# Altium project NFC-Reader.PrjPcb (part 8 of 11)
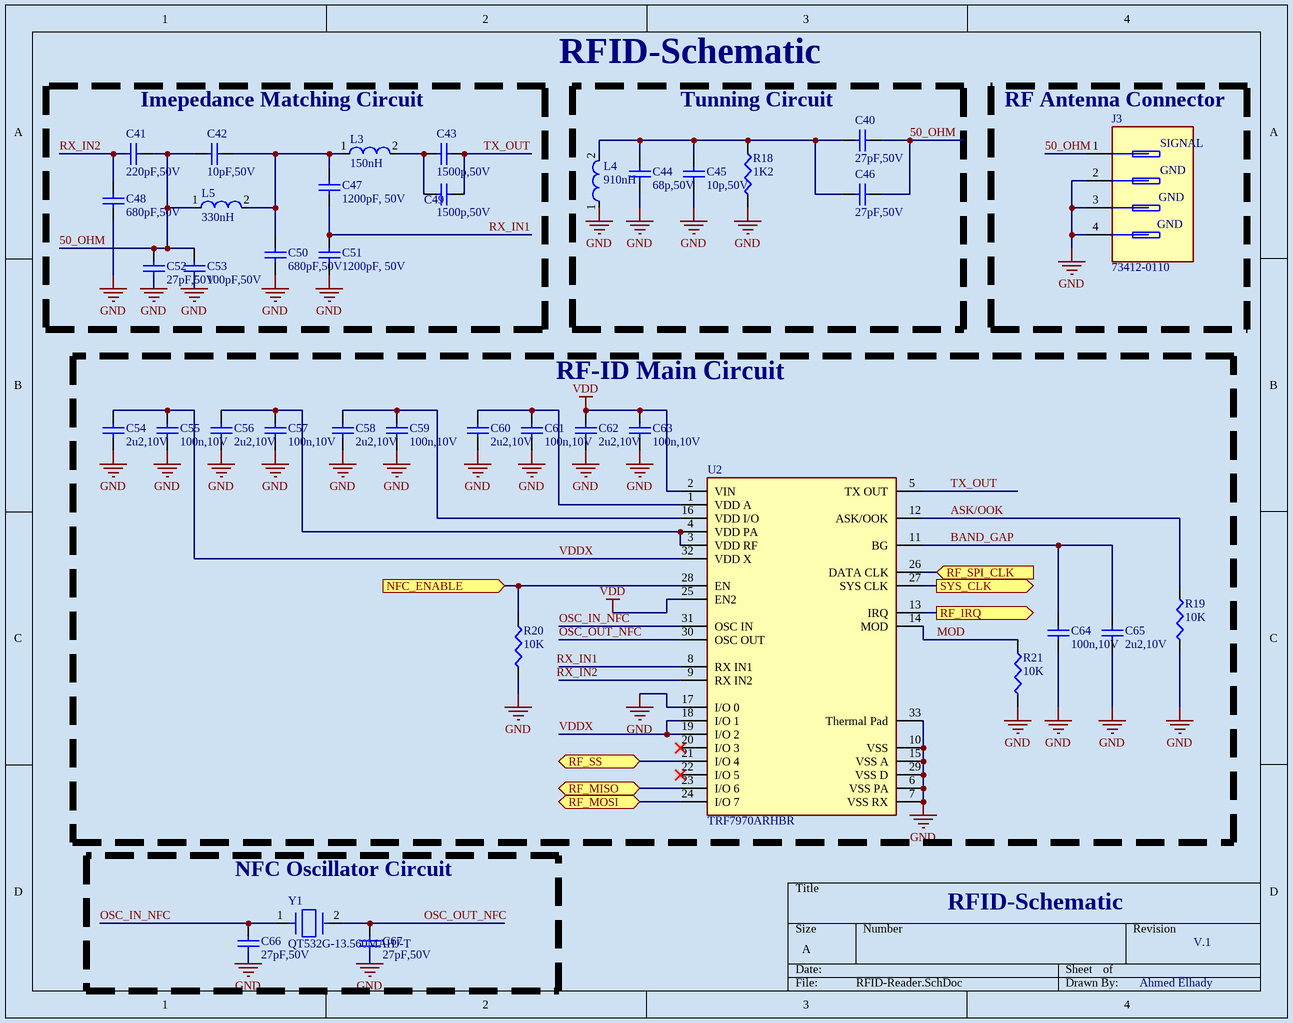
[diagram p11: RFID-Reader.SchDoc]

## Sheet RFID-Reader.SchDoc (continued)
### Library data of the parts
C40 C46 C52 C66 C67 = CC0402JRNPO9BN270: 27 pF ±5% 50V Ceramic Capacitor C0G, NP0 0402 (1005 Metric); Manufacturer: Yageo Group; Temperature Coefficient: 30ppm/°C; Supplier: DigiKey; Manufacturer Part Number: CC0402JRNPO9BN270; RoHS: Compliant; Category: Ceramic Capacitors; Stock: 41685; Pricing: 1=0.1, 10=0.024, 50=0.0156, 100=0.0133, 500=0.00934, 1000=0.00812, 2500=0.00685, 5000=0.00609, 10000=0.00546, 20000=0.00495, 30000=0.0047, 50000=0.0047 (USD); Value: 27pF; Case/Package: 0402; Case Code (Imperial): 0402; Case Code (Metric): 1005; China RoHS: Compliant; Composition: Ceramic; Depth: 500µm; Dielectric: C0G; Dielectric Material: Ceramic; Halogen Free: Halogen Free; Height: 500µm; Lead Free: Lead Free; Length: 1mm; Lifecycle Status: Production; Max Operating Temperature: 125°C; Min Operating Temperature: -55°C; Mounting Technology: Surface Mount; Pins: 2; Number of Terminals: 2; Radiation Hardening: No; REACH SVHC: Yes; Schedule B: 8532240020, 8532240020|8532240020, 8532240020|8532240020|8532240020, 8532240020|8532240020|8532240020|8532240020; Termination: SMD/SMT; Thickness: 558.8µm; Tolerance: 5%; Voltage Rating: 50V; Voltage Rating (DC): 50V; Width: 500µm; ComponentLink1URL: https://datasheet.octopart.com:443/CC0402JRNPO9BN270-Yageo-datasheet-182140217.pdf?src-supplier=IHS; ComponentLink1Description: https://datasheet.octopart.com:443/CC0402JRNPO9BN270-Yageo-datasheet-182140217.pdf?src-supplier=IHS; ComponentLink2URL: https://datasheet.octopart.com:443/CC0402JRNPO9BN270-Yageo-datasheet-10406438.pdf?src-supplier=element14+APAC; ComponentLink2Description: https://datasheet.octopart.com:443/CC0402JRNPO9BN270-Yageo-datasheet-10406438.pdf?src-supplier=element14+APAC; ComponentLink3URL: https://datasheet.octopart.com:443/CC0402JRNPO9BN270-Yageo-datasheet-67645495.pdf?src-supplier=element14+APAC; ComponentLink3Description: https://datasheet.octopart.com:443/CC0402JRNPO9BN270-Yageo-datasheet-67645495.pdf?src-supplier=element14+APAC; ComponentLink4URL: https://datasheet.octopart.com:443/CC0402JRNPO9BN270-Yageo-datasheet-10882999.pdf?src-supplier=element14+APAC; ComponentLink4Description: https://datasheet.octopart.com:443/CC0402JRNPO9BN270-Yageo-datasheet-10882999.pdf?src-supplier=element14+APAC; ComponentLink5URL: https://datasheet.octopart.com:443/CC0402JRNPO9BN270-Yageo-datasheet-151948684.pdf?src-supplier=Farnell; ComponentLink5Description: https://datasheet.octopart.com:443/CC0402JRNPO9BN270-Yageo-datasheet-151948684.pdf?src-supplier=Farnell; ComponentLink6URL: https://datasheet.octopart.com:443/CC0402JRNPO9BN270-Yageo-datasheet-65873193.pdf?src-supplier=Farnell; ComponentLink6Description: https://datasheet.octopart.com:443/CC0402JRNPO9BN270-Yageo-datasheet-65873193.pdf?src-supplier=Farnell; ComponentLink7URL: https://datasheet.octopart.com:443/CC0402JRNPO9BN270-Yageo-datasheet-137875056.pdf?src-supplier=Future+Electronics; ComponentLink7Description: https://datasheet.octopart.com:443/CC0402JRNPO9BN270-Yageo-datasheet-137875056.pdf?src-supplier=Future+Electronics; ComponentLink8URL: https://datasheet.octopart.com:443/CC0402JRNPO9BN270-Yageo-datasheet-136957424.pdf?src-supplier=Future+Electronics; ComponentLink8Description: https://datasheet.octopart.com:443/CC0402JRNPO9BN270-Yageo-datasheet-136957424.pdf?src-supplier=Future+Electronics; ComponentLink9URL: https://datasheet.octopart.com:443/CC0402JRNPO9BN270-Yageo-datasheet-137700082.pdf?src-supplier=Future+Electronics; ComponentLink9Description: https://datasheet.octopart.com:443/CC0402JRNPO9BN270-Yageo-datasheet-137700082.pdf?src-supplier=Future+Electronics; ComponentLink10URL: https://datasheet.octopart.com:443/CC0402JRNPO9BN270-Yageo-datasheet-78855684.pdf?src-supplier=Future+Electronics; ComponentLink10Description: https://datasheet.octopart.com:443/CC0402JRNPO9BN270-Yageo-datasheet-78855684.pdf?src-supplier=Future+Electronics; ComponentLink11URL: https://datasheet.octopart.com:443/CC0402JRNPO9BN270-Yageo-datasheet-16730043.pdf?src-supplier=Future+Electronics; ComponentLink11Description: https://datasheet.octopart.com:443/CC0402JRNPO9BN270-Yageo-datasheet-16730043.pdf?src-supplier=Future+Electronics; ComponentLink12URL: https://datasheet.octopart.com:443/CC0402JRNPO9BN270-Yageo-datasheet-12589826.pdf?src-supplier=Future+Electronics; ComponentLink12Description: https://datasheet.octopart.com:443/CC0402JRNPO9BN270-Yageo-datasheet-12589826.pdf?src-supplier=Future+Electronics; ComponentLink13URL: https://datasheet.octopart.com:443/CC0402JRNPO9BN270-Yageo-datasheet-181967032.pdf?src-supplier=Newark; ComponentLink13Description: https://datasheet.octopart.com:443/CC0402JRNPO9BN270-Yageo-datasheet-181967032.pdf?src-supplier=Newark; ComponentLink14URL: https://datasheet.octopart.com:443/CC0402JRNPO9BN270-Yageo-datasheet-8817079.pdf?src-supplier=element14; ComponentLink14Description: https://datasheet.octopart.com:443/CC0402JRNPO9BN270-Yageo-datasheet-8817079.pdf?src-supplier=element14; ComponentLink15URL: https://datasheet.octopart.com:443/CC0402JRNPO9BN270-Yageo-datasheet-8324240.pdf?src-supplier=element14; ComponentLink15Description: https://datasheet.octopart.com:443/CC0402JRNPO9BN270-Yageo-datasheet-8324240.pdf?src-supplier=element14; ComponentLink16URL: https://datasheet.octopart.com:443/CC0402JRNPO9BN270-Yageo-datasheet-504625.pdf?src-supplier=element14; ComponentLink16Description: https://datasheet.octopart.com:443/CC0402JRNPO9BN270-Yageo-datasheet-504625.pdf?src-supplier=element14; ComponentLink17URL: https://datasheet.octopart.com:443/CC0402JRNPO9BN270-Yageo-datasheet-5321569.pdf?src-supplier=element14; ComponentLink17Description: https://datasheet.octopart.com:443/CC0402JRNPO9BN270-Yageo-datasheet-5321569.pdf?src-supplier=element14; ComponentLink18URL: http://sigma.octopart.com:80/rohs_statement/Yageo-company-2.pdf?src-supplier=Compliance+Statements; ComponentLink18Description: http://sigma.octopart.com:80/rohs_statement/Yageo-company-2.pdf?src-supplier=Compliance+Statements; ComponentLink19URL: http://sigma.octopart.com:80/conflict_mineral_statement/Yageo-company-3.pdf?src-supplier=Compliance+Statements; ComponentLink19Description: http://sigma.octopart.com:80/conflict_mineral_statement/Yageo-company-3.pdf?src-supplier=Compliance+Statements; LCSC PN: C107002
C41 = CC0402JRNPO8BN221: 220 pF ±5% 25V Ceramic Capacitor C0G, NP0 0402 (1005 Metric); Manufacturer: Yageo Group; Supplier: DigiKey; Manufacturer Part Number: CC0402JRNPO8BN221; RoHS: Compliant; Category: Ceramic Capacitors; Stock: 15798; Pricing: 1=0.1, 10=0.033, 50=0.0218, 100=0.0187, 500=0.01332, 1000=0.01168, 2500=0.00996, 5000=0.00893 (USD); Value: 220pF; Case/Package: 0402; Case Code (Imperial): 0402; Case Code (Metric): 1005; China RoHS: Compliant; Composition: Ceramic; Depth: 500µm; Dielectric: C0G; Dielectric Material: Ceramic; Halogen Free: Halogen Free; Height: 500µm; Lead Free: Lead Free; Length: 1mm; Lifecycle Status: Production; Max Operating Temperature: 125°C; Min Operating Temperature: -55°C; Mounting Technology: Surface Mount; Number of Terminals: 2; Packaging: Digi-Reel®; Radiation Hardening: No; REACH SVHC: Yes; Schedule B: 8532240020, 8532240020|8532240020, 8532240020|8532240020|8532240020, 8532240020|8532240020|8532240020|8532240020; Termination: SMD/SMT; Thickness: 558.8µm; Tolerance: 5%; Voltage Rating: 25V; Voltage Rating (DC): 25V; Weight: 652.039032µg; Width: 500µm; ComponentLink1URL: https://datasheet.octopart.com:443/CC0402JRNPO8BN221-Yageo-datasheet-182140217.pdf?src-supplier=IHS; ComponentLink1Description: https://datasheet.octopart.com:443/CC0402JRNPO8BN221-Yageo-datasheet-182140217.pdf?src-supplier=IHS; ComponentLink2URL: https://datasheet.octopart.com:443/CC0402JRNPO8BN221-Yageo-datasheet-182878122.pdf?src-supplier=Farnell; ComponentLink2Description: https://datasheet.octopart.com:443/CC0402JRNPO8BN221-Yageo-datasheet-182878122.pdf?src-supplier=Farnell; ComponentLink3URL: https://datasheet.octopart.com:443/CC0402JRNPO8BN221-Yageo-Group-datasheet-188689597.pdf?src-supplier=Farnell; ComponentLink3Description: https://datasheet.octopart.com:443/CC0402JRNPO8BN221-Yageo-Group-datasheet-188689597.pdf?src-supplier=Farnell; ComponentLink4URL: https://datasheet.octopart.com:443/CC0402JRNPO8BN221-Yageo-datasheet-151948684.pdf?src-supplier=Newark; ComponentLink4Description: https://datasheet.octopart.com:443/CC0402JRNPO8BN221-Yageo-datasheet-151948684.pdf?src-supplier=Newark; ComponentLink5URL: https://datasheet.octopart.com:443/CC0402JRNPO8BN221-Yageo-datasheet-137875056.pdf?src-supplier=JRH+Electronics; ComponentLink5Description: https://datasheet.octopart.com:443/CC0402JRNPO8BN221-Yageo-datasheet-137875056.pdf?src-supplier=JRH+Electronics; ComponentLink6URL: https://datasheet.octopart.com:443/CC0402JRNPO8BN221-Yageo-datasheet-10406438.pdf?src-supplier=_legacy+Avnet; ComponentLink6Description: https://datasheet.octopart.com:443/CC0402JRNPO8BN221-Yageo-datasheet-10406438.pdf?src-supplier=_legacy+Avnet; ComponentLink7URL: https://datasheet.octopart.com:443/CC0402JRNPO8BN221-Yageo-datasheet-136957424.pdf?src-supplier=Future+Electronics; ComponentLink7Description: https://datasheet.octopart.com:443/CC0402JRNPO8BN221-Yageo-datasheet-136957424.pdf?src-supplier=Future+Electronics; ComponentLink8URL: https://datasheet.octopart.com:443/CC0402JRNPO8BN221-Yageo-datasheet-137700082.pdf?src-supplier=Future+Electronics; ComponentLink8Description: https://datasheet.octopart.com:443/CC0402JRNPO8BN221-Yageo-datasheet-137700082.pdf?src-supplier=Future+Electronics; ComponentLink9URL: https://datasheet.octopart.com:443/CC0402JRNPO8BN221-Yageo-datasheet-78855684.pdf?src-supplier=Future+Electronics; ComponentLink9Description: https://datasheet.octopart.com:443/CC0402JRNPO8BN221-Yageo-datasheet-78855684.pdf?src-supplier=Future+Electronics; ComponentLink10URL: https://datasheet.octopart.com:443/CC0402JRNPO8BN221-Yageo-datasheet-24578986.pdf?src-supplier=Future+Electronics; ComponentLink10Description: https://datasheet.octopart.com:443/CC0402JRNPO8BN221-Yageo-datasheet-24578986.pdf?src-supplier=Future+Electronics; ComponentLink11URL: https://datasheet.octopart.com:443/CC0402JRNPO8BN221-Yageo-datasheet-16730043.pdf?src-supplier=Future+Electronics; ComponentLink11Description: https://datasheet.octopart.com:443/CC0402JRNPO8BN221-Yageo-datasheet-16730043.pdf?src-supplier=Future+Electronics; ComponentLink12URL: https://datasheet.octopart.com:443/CC0402JRNPO8BN221-Yageo-datasheet-12589826.pdf?src-supplier=Future+Electronics; ComponentLink12Description: https://datasheet.octopart.com:443/CC0402JRNPO8BN221-Yageo-datasheet-12589826.pdf?src-supplier=Future+Electronics; ComponentLink13URL: http://sigma.octopart.com:80/rohs_statement/Yageo-company-2.pdf?src-supplier=Compliance+Statements; ComponentLink13Description: http://sigma.octopart.com:80/rohs_statement/Yageo-company-2.pdf?src-supplier=Compliance+Statements; ComponentLink14URL: http://sigma.octopart.com:80/conflict_mineral_statement/Yageo-company-3.pdf?src-supplier=Compliance+Statements; ComponentLink14Description: http://sigma.octopart.com:80/conflict_mineral_statement/Yageo-company-3.pdf?src-supplier=Compliance+Statements; LCSC PN: C541367
C42 = CC0402JRNPO9BN100: 10 pF ±5% 50V Ceramic Capacitor C0G, NP0 0402 (1005 Metric); Manufacturer: Yageo Group; Insulation Resistance: 100GΩ; Temperature Coefficient: 30ppm/°C; Supplier: DigiKey; Manufacturer Part Number: CC0402JRNPO9BN100; RoHS: Compliant; Category: Ceramic Capacitors; Stock: 623063; Pricing: 1=0.1, 10=0.024, 50=0.0156, 100=0.0133, 500=0.00934, 1000=0.00812, 2500=0.00685, 5000=0.00609, 10000=0.00547, 20000=0.00495, 30000=0.0047, 50000=0.00441, 70000=0.00425, 100000=0.00409, 120000=0.00401, 240000=0.00376, 250000=0.00374 (USD); Value: 10pF; Case/Package: 0402; Case Code (Imperial): 0402; Case Code (Metric): 1005; China RoHS: Compliant; Composition: Ceramic; Depth: 500µm; Dielectric: C0G; Dielectric Material: Ceramic; Halogen Free: Halogen Free; Height: 500µm; Lead Free: Lead Free; Length: 1mm; Lifecycle Status: Production; Max Operating Temperature: 125°C; Min Operating Temperature: -55°C; Mounting Technology: Surface Mount; Pins: 2; Number of Terminals: 2; Radiation Hardening: No; REACH SVHC: Yes; Schedule B: 8532240020, 8532240020|8532240020|8532240020|8532240020|8532240020|8532240020|8532240020|8532240020|8532240020|8532240020|8532240020|8532240020|8532240020|8532240020|8532240020|8532240020|8532240020|8532240020|8532240020|8532240020|8532240020|8532240020|8532240020|85; Termination: SMD/SMT; Thickness: 558.8µm; Tolerance: 5%; Voltage: 50V; Voltage Rating: 50V; Voltage Rating (AC): 50V; Voltage Rating (DC): 50V; Width: 500µm; ComponentLink1URL: https://datasheet.octopart.com:443/CC0402JRNPO9BN100-Yageo-datasheet-182140217.pdf?src-supplier=IHS; ComponentLink1Description: https://datasheet.octopart.com:443/CC0402JRNPO9BN100-Yageo-datasheet-182140217.pdf?src-supplier=IHS; ComponentLink2URL: https://datasheet.octopart.com:443/CC0402JRNPO9BN100-Yageo-datasheet-78855684.pdf?src-supplier=Upverter; ComponentLink2Description: https://datasheet.octopart.com:443/CC0402JRNPO9BN100-Yageo-datasheet-78855684.pdf?src-supplier=Upverter; ComponentLink3URL: https://datasheet.octopart.com:443/CC0402JRNPO9BN100-Yageo-datasheet-10406438.pdf?src-supplier=element14+APAC; ComponentLink3Description: https://datasheet.octopart.com:443/CC0402JRNPO9BN100-Yageo-datasheet-10406438.pdf?src-supplier=element14+APAC; ComponentLink4URL: https://datasheet.octopart.com:443/CC0402JRNPO9BN100-Yageo-datasheet-151948684.pdf?src-supplier=element14+APAC; ComponentLink4Description: https://datasheet.octopart.com:443/CC0402JRNPO9BN100-Yageo-datasheet-151948684.pdf?src-supplier=element14+APAC; ComponentLink5URL: https://datasheet.octopart.com:443/CC0402JRNPO9BN100-Yageo-datasheet-65873193.pdf?src-supplier=element14+APAC; ComponentLink5Description: https://datasheet.octopart.com:443/CC0402JRNPO9BN100-Yageo-datasheet-65873193.pdf?src-supplier=element14+APAC; ComponentLink6URL: https://datasheet.octopart.com:443/CC0402JRNPO9BN100-Yageo-datasheet-67645495.pdf?src-supplier=element14+APAC; ComponentLink6Description: https://datasheet.octopart.com:443/CC0402JRNPO9BN100-Yageo-datasheet-67645495.pdf?src-supplier=element14+APAC; ComponentLink7URL: https://datasheet.octopart.com:443/CC0402JRNPO9BN100-Yageo-datasheet-10882999.pdf?src-supplier=element14+APAC; ComponentLink7Description: https://datasheet.octopart.com:443/CC0402JRNPO9BN100-Yageo-datasheet-10882999.pdf?src-supplier=element14+APAC; ComponentLink8URL: https://datasheet.octopart.com:443/CC0402JRNPO9BN100-Yageo-datasheet-504625.pdf?src-supplier=element14; ComponentLink8Description: https://datasheet.octopart.com:443/CC0402JRNPO9BN100-Yageo-datasheet-504625.pdf?src-supplier=element14; ComponentLink9URL: https://datasheet.octopart.com:443/CC0402JRNPO9BN100-Yageo-datasheet-8817079.pdf?src-supplier=element14; ComponentLink9Description: https://datasheet.octopart.com:443/CC0402JRNPO9BN100-Yageo-datasheet-8817079.pdf?src-supplier=element14; ComponentLink10URL: https://datasheet.octopart.com:443/CC0402JRNPO9BN100-Yageo-datasheet-8324240.pdf?src-supplier=element14; ComponentLink10Description: https://datasheet.octopart.com:443/CC0402JRNPO9BN100-Yageo-datasheet-8324240.pdf?src-supplier=element14; ComponentLink11URL: https://datasheet.octopart.com:443/CC0402JRNPO9BN100-Yageo-datasheet-5321569.pdf?src-supplier=element14; ComponentLink11Description: https://datasheet.octopart.com:443/CC0402JRNPO9BN100-Yageo-datasheet-5321569.pdf?src-supplier=element14; ComponentLink12URL: https://datasheet.octopart.com:443/CC0402JRNPO9BN100-Yageo-datasheet-5301394.pdf?src-supplier=Newark; ComponentLink12Description: https://datasheet.octopart.com:443/CC0402JRNPO9BN100-Yageo-datasheet-5301394.pdf?src-supplier=Newark; ComponentLink13URL: https://datasheet.octopart.com:443/CC0402JRNPO9BN100-Yageo-datasheet-182050769.pdf?src-supplier=Newark; ComponentLink13Description: https://datasheet.octopart.com:443/CC0402JRNPO9BN100-Yageo-datasheet-182050769.pdf?src-supplier=Newark; ComponentLink14URL: https://datasheet.octopart.com:443/CC0402JRNPO9BN100-Yageo-datasheet-182050768.pdf?src-supplier=Newark; ComponentLink14Description: https://datasheet.octopart.com:443/CC0402JRNPO9BN100-Yageo-datasheet-182050768.pdf?src-supplier=Newark; ComponentLink15URL: https://datasheet.octopart.com:443/CC0402JRNPO9BN100-Yageo-datasheet-137875056.pdf?src-supplier=Future+Electronics; ComponentLink15Description: https://datasheet.octopart.com:443/CC0402JRNPO9BN100-Yageo-datasheet-137875056.pdf?src-supplier=Future+Electronics; ComponentLink16URL: https://datasheet.octopart.com:443/CC0402JRNPO9BN100-Yageo-datasheet-136957424.pdf?src-supplier=Future+Electronics; ComponentLink16Description: https://datasheet.octopart.com:443/CC0402JRNPO9BN100-Yageo-datasheet-136957424.pdf?src-supplier=Future+Electronics; ComponentLink17URL: https://datasheet.octopart.com:443/CC0402JRNPO9BN100-Yageo-datasheet-137700082.pdf?src-supplier=Future+Electronics; ComponentLink17Description: https://datasheet.octopart.com:443/CC0402JRNPO9BN100-Yageo-datasheet-137700082.pdf?src-supplier=Future+Electronics; ComponentLink18URL: https://datasheet.octopart.com:443/CC0402JRNPO9BN100-Yageo-datasheet-62126864.pdf?src-supplier=Future+Electronics; ComponentLink18Description: https://datasheet.octopart.com:443/CC0402JRNPO9BN100-Yageo-datasheet-62126864.pdf?src-supplier=Future+Electronics; ComponentLink19URL: https://datasheet.octopart.com:443/CC0402JRNPO9BN100-Yageo-datasheet-62091628.pdf?src-supplier=Future+Electronics; ComponentLink19Description: https://datasheet.octopart.com:443/CC0402JRNPO9BN100-Yageo-datasheet-62091628.pdf?src-supplier=Future+Electronics; ComponentLink20URL: https://datasheet.octopart.com:443/CC0402JRNPO9BN100-Yageo-datasheet-24578986.pdf?src-supplier=Future+Electronics; ComponentLink20Description: https://datasheet.octopart.com:443/CC0402JRNPO9BN100-Yageo-datasheet-24578986.pdf?src-supplier=Future+Electronics; ComponentLink21URL: https://datasheet.octopart.com:443/CC0402JRNPO9BN100-Yageo-datasheet-16730043.pdf?src-supplier=Future+Electronics; ComponentLink21Description: https://datasheet.octopart.com:443/CC0402JRNPO9BN100-Yageo-datasheet-16730043.pdf?src-supplier=Future+Electronics; ComponentLink22URL: https://datasheet.octopart.com:443/CC0402JRNPO9BN100-Yageo-datasheet-12589826.pdf?src-supplier=Future+Electronics; ComponentLink22Description: https://datasheet.octopart.com:443/CC0402JRNPO9BN100-Yageo-datasheet-12589826.pdf?src-supplier=Future+Electronics; ComponentLink23URL: https://datasheet.octopart.com:443/CC0402JRNPO9BN100-Yageo-datasheet-10621397.pdf?src-supplier=Farnell; ComponentLink23Description: https://datasheet.octopart.com:443/CC0402JRNPO9BN100-Yageo-datasheet-10621397.pdf?src-supplier=Farnell; ComponentLink24URL: http://sigma.octopart.com:80/rohs_statement/Yageo-company-2.pdf?src-supplier=Compliance+Statements; ComponentLink24Description: http://sigma.octopart.com:80/rohs_statement/Yageo-company-2.pdf?src-supplier=Compliance+Statements; ComponentLink25URL: http://sigma.octopart.com:80/conflict_mineral_statement/Yageo-company-3.pdf?src-supplier=Compliance+Statements; ComponentLink25Description: http://sigma.octopart.com:80/conflict_mineral_statement/Yageo-company-3.pdf?src-supplier=Compliance+Statements; LCSC PN: C106199
C43 C49 = GRM155R71H152KA01D: 1500 pF ±10% 50V Ceramic Capacitor X7R 0402 (1005 Metric); Manufacturer: Murata; Manufacturer Lifecycle Status: NRND; Value: 1.5nF; Supplier: DigiKey; Manufacturer Part Number: GRM155R71H152KA01D; RoHS: Compliant; Category: Ceramic Capacitors; Stock: 112151; Pricing: 1=0.1, 10=0.021, 50=0.0138, 100=0.0117, 500=0.00816, 1000=0.00708, 2500=0.00572, 5000=0.00527, 10000=0.00425, 20000=0.00326, 30000=0.00324, 50000=0.00322, 70000=0.0032, 100000=0.00314, 120000=0.00308, 240000=0.00288, 250000=0.00287 (USD); Case/Package: 0402; Case Code (Imperial): 0402; Case Code (Metric): 1005; Depth: 500µm; Dielectric: X7R; Dielectric Material: Ceramic; Height: 500µm; Lead Free: Lead Free; Length: 1mm; Lifecycle Status: NRND; Material: Ceramic; Max Operating Temperature: 125°C; Min Operating Temperature: -55°C; Mounting Technology: Surface Mount; Pins: 2; Number of Terminals: 2; Packaging: Cut Tape; Radiation Hardening: No; REACH SVHC: Yes; Schedule B: 8532240020, 8532240020|8532240020, 8532240020|8532240020|8532240020, 8532240020|8532240020|8532240020|8532240020; Termination: SMD/SMT; Thickness: 500µm; Tolerance: 10%; Voltage: 50V; Voltage Rating: 50V; Voltage Rating (DC): 50V; Width: 500µm; ComponentLink1URL: https://datasheet.octopart.com:443/GRM155R71H152KA01D-Murata-datasheet-8817987.pdf?src-supplier=element14+APAC; ComponentLink1Description: https://datasheet.octopart.com:443/GRM155R71H152KA01D-Murata-datasheet-8817987.pdf?src-supplier=element14+APAC; ComponentLink2URL: https://datasheet.octopart.com:443/GRM155R71H152KA01D-Murata-datasheet-62317135.pdf?src-supplier=element14+APAC; ComponentLink2Description: https://datasheet.octopart.com:443/GRM155R71H152KA01D-Murata-datasheet-62317135.pdf?src-supplier=element14+APAC; ComponentLink3URL: https://datasheet.octopart.com:443/GRM155R71H152KA01D-Murata-datasheet-8326276.pdf?src-supplier=_legacy+Avnet; ComponentLink3Description: https://datasheet.octopart.com:443/GRM155R71H152KA01D-Murata-datasheet-8326276.pdf?src-supplier=_legacy+Avnet; ComponentLink4URL: https://datasheet.octopart.com/GRM155R71H152KA01D-Murata-datasheet-12534922.pdf; ComponentLink4Description: https://datasheet.octopart.com/GRM155R71H152KA01D-Murata-datasheet-12534922.pdf; ComponentLink5URL: https://datasheet.octopart.com/GRM155R71H152KA01D-Murata-datasheet-12515295.pdf; ComponentLink5Description: https://datasheet.octopart.com/GRM155R71H152KA01D-Murata-datasheet-12515295.pdf; ComponentLink6URL: https://datasheet.octopart.com/GRM155R71H152KA01D-Murata-datasheet-12510076.pdf; ComponentLink6Description: https://datasheet.octopart.com/GRM155R71H152KA01D-Murata-datasheet-12510076.pdf; ComponentLink7URL: https://datasheet.octopart.com/GRM155R71H152KA01D-Murata-datasheet-11978611.pdf; ComponentLink7Description: https://datasheet.octopart.com/GRM155R71H152KA01D-Murata-datasheet-11978611.pdf; ComponentLink8URL: https://datasheet.octopart.com/GRM155R71H152KA01D-Murata-datasheet-10025737.pdf; ComponentLink8Description: https://datasheet.octopart.com/GRM155R71H152KA01D-Murata-datasheet-10025737.pdf; ComponentLink9URL: https://datasheet.octopart.com/GRM155R71H152KA01D-Murata-datasheet-8819587.pdf; ComponentLink9Description: https://datasheet.octopart.com/GRM155R71H152KA01D-Murata-datasheet-8819587.pdf; ComponentLink10URL: https://datasheet.octopart.com:443/GRM155R71H152KA01D-Murata-datasheet-141266224.pdf?src-supplier=Ciiva; ComponentLink10Description: https://datasheet.octopart.com:443/GRM155R71H152KA01D-Murata-datasheet-141266224.pdf?src-supplier=Ciiva; ComponentLink11URL: https://datasheet.octopart.com:443/GRM155R71H152KA01D-Murata-datasheet-140691779.pdf?src-supplier=Ciiva; ComponentLink11Description: https://datasheet.octopart.com:443/GRM155R71H152KA01D-Murata-datasheet-140691779.pdf?src-supplier=Ciiva; ComponentLink12URL: https://datasheet.octopart.com:443/GRM155R71H152KA01D-Murata-datasheet-138797361.pdf?src-supplier=Ciiva; ComponentLink12Description: https://datasheet.octopart.com:443/GRM155R71H152KA01D-Murata-datasheet-138797361.pdf?src-supplier=Ciiva; ComponentLink13URL: https://datasheet.octopart.com:443/GRM155R71H152KA01D-Murata-datasheet-138740991.pdf?src-supplier=Ciiva; ComponentLink13Description: https://datasheet.octopart.com:443/GRM155R71H152KA01D-Murata-datasheet-138740991.pdf?src-supplier=Ciiva; ComponentLink14URL: https://datasheet.octopart.com:443/GRM155R71H152KA01D-Murata-datasheet-81455584.pdf?src-supplier=TME; ComponentLink14Description: https://datasheet.octopart.com:443/GRM155R71H152KA01D-Murata-datasheet-81455584.pdf?src-supplier=TME; ComponentLink15URL: https://datasheet.octopart.com:443/GRM155R71H152KA01D-Murata-datasheet-22122223.pdf?src-supplier=Future+Electronics; ComponentLink15Description: https://datasheet.octopart.com:443/GRM155R71H152KA01D-Murata-datasheet-22122223.pdf?src-supplier=Future+Electronics; ComponentLink16URL: https://datasheet.octopart.com:443/GRM155R71H152KA01D-Murata-datasheet-44106597.pdf?src-supplier=Future+Electronics; ComponentLink16Description: https://datasheet.octopart.com:443/GRM155R71H152KA01D-Murata-datasheet-44106597.pdf?src-supplier=Future+Electronics; ComponentLink17URL: https://datasheet.octopart.com:443/GRM155R71H152KA01D-Murata-datasheet-11794207.pdf?src-supplier=Arrow+Electronics; ComponentLink17Description: https://datasheet.octopart.com:443/GRM155R71H152KA01D-Murata-datasheet-11794207.pdf?src-supplier=Arrow+Electronics; ComponentLink18URL: https://datasheet.octopart.com:443/GRM155R71H152KA01D.-Murata-datasheet-5332913.pdf?src-supplier=Farnell; ComponentLink18Description: https://datasheet.octopart.com:443/GRM155R71H152KA01D.-Murata-datasheet-5332913.pdf?src-supplier=Farnell; ComponentLink19URL: https://datasheet.octopart.com:443/GRM155R71H152KA01D-Murata-datasheet-8634235.pdf?src-supplier=Jameco; ComponentLink19Description: https://datasheet.octopart.com:443/GRM155R71H152KA01D-Murata-datasheet-8634235.pdf?src-supplier=Jameco; ComponentLink20URL: https://datasheet.octopart.com:443/GRM155R71H152KA01D-Murata-datasheet-118811.pdf?src-supplier=DigiKey; ComponentLink20Description: https://datasheet.octopart.com:443/GRM155R71H152KA01D-Murata-datasheet-118811.pdf?src-supplier=DigiKey; ComponentLink21URL: http://sigma.octopart.com:80/reach_statement/Murata-company-16.pdf?src-supplier=Compliance+Statements; ComponentLink21Description: http://sigma.octopart.com:80/reach_statement/Murata-company-16.pdf?src-supplier=Compliance+Statements; LCSC PN: C77021
C44 = C1005C0G1H680J050BA: 68 pF ±5% 50V Ceramic Capacitor C0G, NP0 0402 (1005 Metric); Manufacturer: TDK; Manufacturer Lifecycle Status: PRODUCTION (NOT RECOMMENDED FOR NEW DESIGN); Value: 68pF; Temperature Coefficient: 30ppm/°C; Supplier: DigiKey; Manufacturer Part Number: C1005C0G1H680J050BA; RoHS: Compliant; Category: Ceramic Capacitors; Stock: 79405; Pricing: 1=0.1, 10=0.036, 50=0.0246, 100=0.021, 500=0.01508, 1000=0.01326, 2500=0.01134, 5000=0.0102 (USD); Case/Package: 0402; Case Code (Imperial): 0402; Case Code (Metric): 1005; China RoHS: Compliant; Depth: 500µm; Dielectric: C0G; Dielectric Material: Ceramic; Height: 500µm; Lead Free: Lead Free; Length: 1mm; Lifecycle Status: NRND; Material: Ceramic; Max Length: 1.05mm; Max Operating Temperature: 125°C; Max Width: 550µm; Min Length: 950µm; Min Operating Temperature: -55°C; Min Width: 450µm; Mounting Technology: Surface Mount; Pins: 2; Number of Terminals: 2; Radiation Hardening: No; REACH SVHC: Yes; Schedule B: 8532240020, 8532240020|8532240020|8532240020|8532240020|8532240020; Termination: SMD/SMT; Tolerance: 5%; Voltage Rating: 50V; Voltage Rating (DC): 50V; Weight: 652.039032µg; Width: 500µm; ComponentLink1URL: https://datasheet.octopart.com:443/C1005C0G1H680J050BA-TDK-datasheet-175423548.pdf?src-supplier=IHS; ComponentLink1Description: https://datasheet.octopart.com:443/C1005C0G1H680J050BA-TDK-datasheet-175423548.pdf?src-supplier=IHS; ComponentLink2URL: https://datasheet.octopart.com:443/C1005C0G1H680J050BA-TDK-datasheet-151546523.pdf?src-supplier=TDK; ComponentLink2Description: https://datasheet.octopart.com:443/C1005C0G1H680J050BA-TDK-datasheet-151546523.pdf?src-supplier=TDK; ComponentLink3URL: https://datasheet.octopart.com:443/C1005C0G1H680J050BA-TDK-datasheet-41194876.pdf?src-supplier=element14+APAC; ComponentLink3Description: https://datasheet.octopart.com:443/C1005C0G1H680J050BA-TDK-datasheet-41194876.pdf?src-supplier=element14+APAC; ComponentLink4URL: https://datasheet.octopart.com:443/C1005C0G1H680J050BA-TDK-datasheet-82475248.pdf?src-supplier=element14+APAC; ComponentLink4Description: https://datasheet.octopart.com:443/C1005C0G1H680J050BA-TDK-datasheet-82475248.pdf?src-supplier=element14+APAC; ComponentLink5URL: https://datasheet.octopart.com:443/C1005C0G1H680J050BA-TDK-datasheet-20681607.pdf?src-supplier=element14+APAC; ComponentLink5Description: https://datasheet.octopart.com:443/C1005C0G1H680J050BA-TDK-datasheet-20681607.pdf?src-supplier=element14+APAC; ComponentLink6URL: https://datasheet.octopart.com:443/C1005C0G1H680J050BA-TDK-datasheet-13376850.pdf?src-supplier=element14+APAC; ComponentLink6Description: https://datasheet.octopart.com:443/C1005C0G1H680J050BA-TDK-datasheet-13376850.pdf?src-supplier=element14+APAC; ComponentLink7URL: https://datasheet.octopart.com:443/C1005C0G1H680J050BA-TDK-datasheet-10978788.pdf?src-supplier=element14+APAC; ComponentLink7Description: https://datasheet.octopart.com:443/C1005C0G1H680J050BA-TDK-datasheet-10978788.pdf?src-supplier=element14+APAC; LCSC PN: C3865634
C45 = CC0402JRNPO9BN100: 10 pF ±5% 50V Ceramic Capacitor C0G, NP0 0402 (1005 Metric); Manufacturer: Yageo Group; Value: 10pF; Insulation Resistance: 100GΩ; Temperature Coefficient: 30ppm/°C; Supplier: DigiKey; Manufacturer Part Number: CC0402JRNPO9BN100; RoHS: Compliant; Category: Ceramic Capacitors; Stock: 623063; Pricing: 1=0.1, 10=0.024, 50=0.0156, 100=0.0133, 500=0.00934, 1000=0.00812, 2500=0.00685, 5000=0.00609, 10000=0.00547, 20000=0.00495, 30000=0.0047, 50000=0.00441, 70000=0.00425, 100000=0.00409, 120000=0.00401, 240000=0.00376, 250000=0.00374 (USD); Case/Package: 0402; Case Code (Imperial): 0402; Case Code (Metric): 1005; China RoHS: Compliant; Composition: Ceramic; Depth: 500µm; Dielectric: C0G; Dielectric Material: Ceramic; Halogen Free: Halogen Free; Height: 500µm; Lead Free: Lead Free; Length: 1mm; Lifecycle Status: Production; Max Operating Temperature: 125°C; Min Operating Temperature: -55°C; Mounting Technology: Surface Mount; Pins: 2; Number of Terminals: 2; Radiation Hardening: No; REACH SVHC: Yes; Schedule B: 8532240020, 8532240020|8532240020|8532240020|8532240020|8532240020|8532240020|8532240020|8532240020|8532240020|8532240020|8532240020|8532240020|8532240020|8532240020|8532240020|8532240020|8532240020|8532240020|8532240020|8532240020|8532240020|8532240020|8532240020|85; Termination: SMD/SMT; Thickness: 558.8µm; Tolerance: 5%; Voltage: 50V; Voltage Rating: 50V; Voltage Rating (AC): 50V; Voltage Rating (DC): 50V; Width: 500µm; ComponentLink1URL: https://datasheet.octopart.com:443/CC0402JRNPO9BN100-Yageo-datasheet-182140217.pdf?src-supplier=IHS; ComponentLink1Description: https://datasheet.octopart.com:443/CC0402JRNPO9BN100-Yageo-datasheet-182140217.pdf?src-supplier=IHS; ComponentLink2URL: https://datasheet.octopart.com:443/CC0402JRNPO9BN100-Yageo-datasheet-78855684.pdf?src-supplier=Upverter; ComponentLink2Description: https://datasheet.octopart.com:443/CC0402JRNPO9BN100-Yageo-datasheet-78855684.pdf?src-supplier=Upverter; ComponentLink3URL: https://datasheet.octopart.com:443/CC0402JRNPO9BN100-Yageo-datasheet-10406438.pdf?src-supplier=element14+APAC; ComponentLink3Description: https://datasheet.octopart.com:443/CC0402JRNPO9BN100-Yageo-datasheet-10406438.pdf?src-supplier=element14+APAC; ComponentLink4URL: https://datasheet.octopart.com:443/CC0402JRNPO9BN100-Yageo-datasheet-151948684.pdf?src-supplier=element14+APAC; ComponentLink4Description: https://datasheet.octopart.com:443/CC0402JRNPO9BN100-Yageo-datasheet-151948684.pdf?src-supplier=element14+APAC; ComponentLink5URL: https://datasheet.octopart.com:443/CC0402JRNPO9BN100-Yageo-datasheet-65873193.pdf?src-supplier=element14+APAC; ComponentLink5Description: https://datasheet.octopart.com:443/CC0402JRNPO9BN100-Yageo-datasheet-65873193.pdf?src-supplier=element14+APAC; ComponentLink6URL: https://datasheet.octopart.com:443/CC0402JRNPO9BN100-Yageo-datasheet-67645495.pdf?src-supplier=element14+APAC; ComponentLink6Description: https://datasheet.octopart.com:443/CC0402JRNPO9BN100-Yageo-datasheet-67645495.pdf?src-supplier=element14+APAC; ComponentLink7URL: https://datasheet.octopart.com:443/CC0402JRNPO9BN100-Yageo-datasheet-10882999.pdf?src-supplier=element14+APAC; ComponentLink7Description: https://datasheet.octopart.com:443/CC0402JRNPO9BN100-Yageo-datasheet-10882999.pdf?src-supplier=element14+APAC; ComponentLink8URL: https://datasheet.octopart.com:443/CC0402JRNPO9BN100-Yageo-datasheet-504625.pdf?src-supplier=element14; ComponentLink8Description: https://datasheet.octopart.com:443/CC0402JRNPO9BN100-Yageo-datasheet-504625.pdf?src-supplier=element14; ComponentLink9URL: https://datasheet.octopart.com:443/CC0402JRNPO9BN100-Yageo-datasheet-8817079.pdf?src-supplier=element14; ComponentLink9Description: https://datasheet.octopart.com:443/CC0402JRNPO9BN100-Yageo-datasheet-8817079.pdf?src-supplier=element14; ComponentLink10URL: https://datasheet.octopart.com:443/CC0402JRNPO9BN100-Yageo-datasheet-8324240.pdf?src-supplier=element14; ComponentLink10Description: https://datasheet.octopart.com:443/CC0402JRNPO9BN100-Yageo-datasheet-8324240.pdf?src-supplier=element14; ComponentLink11URL: https://datasheet.octopart.com:443/CC0402JRNPO9BN100-Yageo-datasheet-5321569.pdf?src-supplier=element14; ComponentLink11Description: https://datasheet.octopart.com:443/CC0402JRNPO9BN100-Yageo-datasheet-5321569.pdf?src-supplier=element14; ComponentLink12URL: https://datasheet.octopart.com:443/CC0402JRNPO9BN100-Yageo-datasheet-5301394.pdf?src-supplier=Newark; ComponentLink12Description: https://datasheet.octopart.com:443/CC0402JRNPO9BN100-Yageo-datasheet-5301394.pdf?src-supplier=Newark; ComponentLink13URL: https://datasheet.octopart.com:443/CC0402JRNPO9BN100-Yageo-datasheet-182050769.pdf?src-supplier=Newark; ComponentLink13Description: https://datasheet.octopart.com:443/CC0402JRNPO9BN100-Yageo-datasheet-182050769.pdf?src-supplier=Newark; ComponentLink14URL: https://datasheet.octopart.com:443/CC0402JRNPO9BN100-Yageo-datasheet-182050768.pdf?src-supplier=Newark; ComponentLink14Description: https://datasheet.octopart.com:443/CC0402JRNPO9BN100-Yageo-datasheet-182050768.pdf?src-supplier=Newark; ComponentLink15URL: https://datasheet.octopart.com:443/CC0402JRNPO9BN100-Yageo-datasheet-137875056.pdf?src-supplier=Future+Electronics; ComponentLink15Description: https://datasheet.octopart.com:443/CC0402JRNPO9BN100-Yageo-datasheet-137875056.pdf?src-supplier=Future+Electronics; ComponentLink16URL: https://datasheet.octopart.com:443/CC0402JRNPO9BN100-Yageo-datasheet-136957424.pdf?src-supplier=Future+Electronics; ComponentLink16Description: https://datasheet.octopart.com:443/CC0402JRNPO9BN100-Yageo-datasheet-136957424.pdf?src-supplier=Future+Electronics; ComponentLink17URL: https://datasheet.octopart.com:443/CC0402JRNPO9BN100-Yageo-datasheet-137700082.pdf?src-supplier=Future+Electronics; ComponentLink17Description: https://datasheet.octopart.com:443/CC0402JRNPO9BN100-Yageo-datasheet-137700082.pdf?src-supplier=Future+Electronics; ComponentLink18URL: https://datasheet.octopart.com:443/CC0402JRNPO9BN100-Yageo-datasheet-62126864.pdf?src-supplier=Future+Electronics; ComponentLink18Description: https://datasheet.octopart.com:443/CC0402JRNPO9BN100-Yageo-datasheet-62126864.pdf?src-supplier=Future+Electronics; ComponentLink19URL: https://datasheet.octopart.com:443/CC0402JRNPO9BN100-Yageo-datasheet-62091628.pdf?src-supplier=Future+Electronics; ComponentLink19Description: https://datasheet.octopart.com:443/CC0402JRNPO9BN100-Yageo-datasheet-62091628.pdf?src-supplier=Future+Electronics; ComponentLink20URL: https://datasheet.octopart.com:443/CC0402JRNPO9BN100-Yageo-datasheet-24578986.pdf?src-supplier=Future+Electronics; ComponentLink20Description: https://datasheet.octopart.com:443/CC0402JRNPO9BN100-Yageo-datasheet-24578986.pdf?src-supplier=Future+Electronics; ComponentLink21URL: https://datasheet.octopart.com:443/CC0402JRNPO9BN100-Yageo-datasheet-16730043.pdf?src-supplier=Future+Electronics; ComponentLink21Description: https://datasheet.octopart.com:443/CC0402JRNPO9BN100-Yageo-datasheet-16730043.pdf?src-supplier=Future+Electronics; ComponentLink22URL: https://datasheet.octopart.com:443/CC0402JRNPO9BN100-Yageo-datasheet-12589826.pdf?src-supplier=Future+Electronics; ComponentLink22Description: https://datasheet.octopart.com:443/CC0402JRNPO9BN100-Yageo-datasheet-12589826.pdf?src-supplier=Future+Electronics; ComponentLink23URL: https://datasheet.octopart.com:443/CC0402JRNPO9BN100-Yageo-datasheet-10621397.pdf?src-supplier=Farnell; ComponentLink23Description: https://datasheet.octopart.com:443/CC0402JRNPO9BN100-Yageo-datasheet-10621397.pdf?src-supplier=Farnell; ComponentLink24URL: http://sigma.octopart.com:80/rohs_statement/Yageo-company-2.pdf?src-supplier=Compliance+Statements; ComponentLink24Description: http://sigma.octopart.com:80/rohs_statement/Yageo-company-2.pdf?src-supplier=Compliance+Statements; ComponentLink25URL: http://sigma.octopart.com:80/conflict_mineral_statement/Yageo-company-3.pdf?src-supplier=Compliance+Statements; ComponentLink25Description: http://sigma.octopart.com:80/conflict_mineral_statement/Yageo-company-3.pdf?src-supplier=Compliance+Statements; LCSC PN: C106199
C47 C51 = GRM155R71H122KA01D: 1200 pF ±10% 50V Ceramic Capacitor X7R 0402 (1005 Metric); Manufacturer: Murata; Manufacturer Lifecycle Status: NRND; Value: 1.2nF; Supplier: DigiKey; Manufacturer Part Number: GRM155R71H122KA01D; RoHS: Compliant; Category: Ceramic Capacitors; Stock: 161514; Pricing: 1=0.1, 10=0.027, 50=0.0184, 100=0.0156, 500=0.01102, 1000=0.00962, 2500=0.00781, 5000=0.00728 (USD); Case/Package: 0402; Case Code (Imperial): 0402; Case Code (Metric): 1005; Depth: 500µm; Dielectric: X7R; Dielectric Material: Ceramic; Height: 500µm; Lead Free: Lead Free; Length: 1mm; Lifecycle Status: NRND; Material: Ceramic; Max Operating Temperature: 125°C; Min Operating Temperature: -55°C; Mounting Technology: Surface Mount; Pins: 2; Number of Terminals: 2; Radiation Hardening: No; REACH SVHC: Yes; Schedule B: 8532240020, 8532240020|8532240020, 8532240020|8532240020|8532240020, 8532240020|8532240020|8532240020|8532240020; Termination: SMD/SMT; Thickness: 500µm; Tolerance: 10%; Voltage: 50V; Voltage Rating: 50V; Voltage Rating (DC): 50V; Width: 500µm; ComponentLink1URL: https://datasheet.octopart.com/GRM155R71H122KA01D-Murata-datasheet-12541967.pdf; ComponentLink1Description: https://datasheet.octopart.com/GRM155R71H122KA01D-Murata-datasheet-12541967.pdf; ComponentLink2URL: https://datasheet.octopart.com/GRM155R71H122KA01D-Murata-datasheet-12515295.pdf; ComponentLink2Description: https://datasheet.octopart.com/GRM155R71H122KA01D-Murata-datasheet-12515295.pdf; ComponentLink3URL: https://datasheet.octopart.com/GRM155R71H122KA01D-Murata-datasheet-12510076.pdf; ComponentLink3Description: https://datasheet.octopart.com/GRM155R71H122KA01D-Murata-datasheet-12510076.pdf; ComponentLink4URL: https://datasheet.octopart.com/GRM155R71H122KA01D-Murata-datasheet-11978611.pdf; ComponentLink4Description: https://datasheet.octopart.com/GRM155R71H122KA01D-Murata-datasheet-11978611.pdf; ComponentLink5URL: https://datasheet.octopart.com/GRM155R71H122KA01D-Murata-datasheet-10025737.pdf; ComponentLink5Description: https://datasheet.octopart.com/GRM155R71H122KA01D-Murata-datasheet-10025737.pdf; ComponentLink6URL: https://datasheet.octopart.com/GRM155R71H122KA01D-Murata-datasheet-8819587.pdf; ComponentLink6Description: https://datasheet.octopart.com/GRM155R71H122KA01D-Murata-datasheet-8819587.pdf; ComponentLink7URL: https://datasheet.octopart.com:443/GRM155R71H122KA01D-Murata-datasheet-140691773.pdf?src-supplier=Ciiva; ComponentLink7Description: https://datasheet.octopart.com:443/GRM155R71H122KA01D-Murata-datasheet-140691773.pdf?src-supplier=Ciiva; ComponentLink8URL: https://datasheet.octopart.com:443/GRM155R71H122KA01D-Murata-datasheet-140689249.pdf?src-supplier=Ciiva; ComponentLink8Description: https://datasheet.octopart.com:443/GRM155R71H122KA01D-Murata-datasheet-140689249.pdf?src-supplier=Ciiva; ComponentLink9URL: https://datasheet.octopart.com:443/GRM155R71H122KA01D-Murata-datasheet-138740985.pdf?src-supplier=Ciiva; ComponentLink9Description: https://datasheet.octopart.com:443/GRM155R71H122KA01D-Murata-datasheet-138740985.pdf?src-supplier=Ciiva; ComponentLink10URL: https://datasheet.octopart.com:443/GRM155R71H122KA01D-Murata-datasheet-22122223.pdf?src-supplier=Future+Electronics; ComponentLink10Description: https://datasheet.octopart.com:443/GRM155R71H122KA01D-Murata-datasheet-22122223.pdf?src-supplier=Future+Electronics; ComponentLink11URL: https://datasheet.octopart.com:443/GRM155R71H122KA01D-Murata-datasheet-44106582.pdf?src-supplier=Future+Electronics; ComponentLink11Description: https://datasheet.octopart.com:443/GRM155R71H122KA01D-Murata-datasheet-44106582.pdf?src-supplier=Future+Electronics; ComponentLink12URL: https://datasheet.octopart.com:443/GRM155R71H122KA01D-Murata-datasheet-102.pdf?src-supplier=DigiKey; ComponentLink12Description: https://datasheet.octopart.com:443/GRM155R71H122KA01D-Murata-datasheet-102.pdf?src-supplier=DigiKey; ComponentLink13URL: http://sigma.octopart.com:80/reach_statement/Murata-company-16.pdf?src-supplier=Compliance+Statements; ComponentLink13Description: http://sigma.octopart.com:80/reach_statement/Murata-company-16.pdf?src-supplier=Compliance+Statements; LCSC PN: C116368
C48 C50 = C0402C681K5RACTU: 680 pF ±10% 50V Ceramic Capacitor X7R 0402 (1005 Metric); Manufacturer: KEMET; Dissipation Factor: 2.5%; Supplier: DigiKey; Manufacturer Part Number: C0402C681K5RACTU; RoHS: Compliant; Category: Ceramic Capacitors; Stock: 53449; Pricing: 1=0.1, 10=0.03, 50=0.0202, 100=0.0172, 500=0.01222, 1000=0.00952, 2500=0.00676, 5000=0.00661, 10000=0.00388 (USD); Value: 680pF; Case/Package: 0402; Case Code (Imperial): 0402; China RoHS: Compliant; Depth: 500µm; Dielectric: X7R; Dielectric Material: Ceramic; Height: 500µm; Lead Free: Lead Free; Lead Pitch: 300µm; Length: 1mm; Lifecycle Status: Production; Material: Ceramic; Max Operating Temperature: 125°C; Min Operating Temperature: -55°C; Mounting Technology: Surface Mount; Pins: 2; Number of Terminals: 2; Packaging: Cut Tape; Radiation Hardening: No; REACH SVHC: Yes; Schedule B: 8532240020, 8532240020|8532240020, 8532240020|8532240020|8532240020, 8532240020|8532240020|8532240020|8532240020; Termination: SMD/SMT; Thickness: 558.8µm; Tolerance: 10%; Voltage: 50V; Voltage Rating: 50V; Voltage Rating (DC): 50V; Width: 500µm; ComponentLink1URL: https://datasheet.octopart.com:443/C0402C681K5RACTU-KEMET-datasheet-178445679.pdf?src-supplier=IHS; ComponentLink1Description: https://datasheet.octopart.com:443/C0402C681K5RACTU-KEMET-datasheet-178445679.pdf?src-supplier=IHS; ComponentLink2URL: https://datasheet.octopart.com:443/C0402C681K5RACTU-KEMET-datasheet-137357759.pdf?src-supplier=Farnell; ComponentLink2Description: https://datasheet.octopart.com:443/C0402C681K5RACTU-KEMET-datasheet-137357759.pdf?src-supplier=Farnell; ComponentLink3URL: https://datasheet.octopart.com:443/C0402C681K5RACTU-KEMET-datasheet-101575575.pdf?src-supplier=Farnell; ComponentLink3Description: https://datasheet.octopart.com:443/C0402C681K5RACTU-KEMET-datasheet-101575575.pdf?src-supplier=Farnell; ComponentLink4URL: https://datasheet.octopart.com:443/C0402C681K5RACTU-KEMET-datasheet-176142131.pdf?src-supplier=Farnell; ComponentLink4Description: https://datasheet.octopart.com:443/C0402C681K5RACTU-KEMET-datasheet-176142131.pdf?src-supplier=Farnell; ComponentLink5URL: https://datasheet.octopart.com:443/C0402C681K5RACTU-Kemet-datasheet-5313890.pdf?src-supplier=Newark; ComponentLink5Description: https://datasheet.octopart.com:443/C0402C681K5RACTU-Kemet-datasheet-5313890.pdf?src-supplier=Newark; ComponentLink6URL: https://datasheet.octopart.com:443/C0402C681K5RACTU-Kemet-datasheet-12608295.pdf?src-supplier=Newark; ComponentLink6Description: https://datasheet.octopart.com:443/C0402C681K5RACTU-Kemet-datasheet-12608295.pdf?src-supplier=Newark; ComponentLink7URL: https://datasheet.octopart.com:443/C0402C681K5RACTU-Kemet-datasheet-11992184.pdf?src-supplier=Newark; ComponentLink7Description: https://datasheet.octopart.com:443/C0402C681K5RACTU-Kemet-datasheet-11992184.pdf?src-supplier=Newark; ComponentLink8URL: https://datasheet.octopart.com:443/C0402C681K5RACTU-Kemet-datasheet-10942409.pdf?src-supplier=Newark; ComponentLink8Description: https://datasheet.octopart.com:443/C0402C681K5RACTU-Kemet-datasheet-10942409.pdf?src-supplier=Newark; ComponentLink9URL: https://datasheet.octopart.com:443/C0402C681K5RACTU-Kemet-datasheet-10404442.pdf?src-supplier=Newark; ComponentLink9Description: https://datasheet.octopart.com:443/C0402C681K5RACTU-Kemet-datasheet-10404442.pdf?src-supplier=Newark; ComponentLink10URL: https://datasheet.octopart.com:443/C0402C681K5RACTU-KEMET-datasheet-176142135.pdf?src-supplier=Newark; ComponentLink10Description: https://datasheet.octopart.com:443/C0402C681K5RACTU-KEMET-datasheet-176142135.pdf?src-supplier=Newark; ComponentLink11URL: https://datasheet.octopart.com:443/C0402C681K5RACTU-Kemet-datasheet-8764837.pdf?src-supplier=Newark; ComponentLink11Description: https://datasheet.octopart.com:443/C0402C681K5RACTU-Kemet-datasheet-8764837.pdf?src-supplier=Newark; ComponentLink12URL: https://datasheet.octopart.com:443/C0402C681K5RACTU-Kemet-datasheet-8480123.pdf?src-supplier=Newark; ComponentLink12Description: https://datasheet.octopart.com:443/C0402C681K5RACTU-Kemet-datasheet-8480123.pdf?src-supplier=Newark; ComponentLink13URL: https://datasheet.octopart.com:443/C0402C681K5RACTU-Kemet-datasheet-5390537.pdf?src-supplier=Newark; ComponentLink13Description: https://datasheet.octopart.com:443/C0402C681K5RACTU-Kemet-datasheet-5390537.pdf?src-supplier=Newark; ComponentLink14URL: https://datasheet.octopart.com:443/C0402C681K5RACTU-Kemet-datasheet-5393970.pdf?src-supplier=Newark; ComponentLink14Description: https://datasheet.octopart.com:443/C0402C681K5RACTU-Kemet-datasheet-5393970.pdf?src-supplier=Newark; ComponentLink15URL: https://datasheet.octopart.com:443/C0402C681K5RACTU-Kemet-datasheet-8502025.pdf?src-supplier=Newark; ComponentLink15Description: https://datasheet.octopart.com:443/C0402C681K5RACTU-Kemet-datasheet-8502025.pdf?src-supplier=Newark; ComponentLink16URL: https://datasheet.octopart.com:443/C0402C681K5RACTU-Kemet-datasheet-7541751.pdf?src-supplier=Newark; ComponentLink16Description: https://datasheet.octopart.com:443/C0402C681K5RACTU-Kemet-datasheet-7541751.pdf?src-supplier=Newark; ComponentLink17URL: https://datasheet.octopart.com:443/C0402C681K5RACTU-Kemet-datasheet-161801.pdf?src-supplier=Newark; ComponentLink17Description: https://datasheet.octopart.com:443/C0402C681K5RACTU-Kemet-datasheet-161801.pdf?src-supplier=Newark; ComponentLink18URL: https://datasheet.octopart.com:443/C0402C681K5RACTU-KEMET-datasheet-157246124.pdf?src-supplier=Electro+Sonic; ComponentLink18Description: https://datasheet.octopart.com:443/C0402C681K5RACTU-KEMET-datasheet-157246124.pdf?src-supplier=Electro+Sonic; ComponentLink19URL: https://datasheet.octopart.com:443/C0402C681K5RACTU-KEMET-datasheet-32036385.pdf?src-supplier=Electro+Sonic; ComponentLink19Description: https://datasheet.octopart.com:443/C0402C681K5RACTU-KEMET-datasheet-32036385.pdf?src-supplier=Electro+Sonic; ComponentLink20URL: https://datasheet.octopart.com:443/C0402C681K5RACTU-KEMET-datasheet-164512540.pdf?src-supplier=TME; ComponentLink20Description: https://datasheet.octopart.com:443/C0402C681K5RACTU-KEMET-datasheet-164512540.pdf?src-supplier=TME; ComponentLink21URL: https://datasheet.octopart.com:443/C0402C681K5RACTU-KEMET-datasheet-113436775.pdf?src-supplier=TME; ComponentLink21Description: https://datasheet.octopart.com:443/C0402C681K5RACTU-KEMET-datasheet-113436775.pdf?src-supplier=TME; ComponentLink22URL: https://datasheet.octopart.com:443/C0402C681K5RACTU-KEMET-datasheet-68331906.pdf?src-supplier=TME; ComponentLink22Description: https://datasheet.octopart.com:443/C0402C681K5RACTU-KEMET-datasheet-68331906.pdf?src-supplier=TME; ComponentLink23URL: https://datasheet.octopart.com:443/C0402C681K5RACTU-KEMET-datasheet-110724412.pdf?src-supplier=RS+(Formerly+Allied+Electronics); ComponentLink23Description: https://datasheet.octopart.com:443/C0402C681K5RACTU-KEMET-datasheet-110724412.pdf?src-supplier=RS+(Formerly+Allied+Electronics); ComponentLink24URL: https://datasheet.octopart.com:443/C0402C681K5RACTU-Kemet-datasheet-60243841.pdf?src-supplier=RS+(Formerly+Allied+Electronics); ComponentLink24Description: https://datasheet.octopart.com:443/C0402C681K5RACTU-Kemet-datasheet-60243841.pdf?src-supplier=RS+(Formerly+Allied+Electronics); ComponentLink25URL: https://datasheet.octopart.com:443/C0402C681K5RACTU-Kemet-datasheet-464.pdf?src-supplier=RS+(Formerly+Allied+Electronics); ComponentLink25Description: https://datasheet.octopart.com:443/C0402C681K5RACTU-Kemet-datasheet-464.pdf?src-supplier=RS+(Formerly+Allied+Electronics); ComponentLink26URL: https://datasheet.octopart.com/C0402C681K5RACTU-KEMET-datasheet-84169754.pdf; ComponentLink26Description: https://datasheet.octopart.com/C0402C681K5RACTU-KEMET-datasheet-84169754.pdf; ComponentLink27URL: https://datasheet.octopart.com:443/C0402C681K5RACTU-Kemet-datasheet-11599449.pdf?src-supplier=Arrow+Electronics; ComponentLink27Description: https://datasheet.octopart.com:443/C0402C681K5RACTU-Kemet-datasheet-11599449.pdf?src-supplier=Arrow+Electronics; LCSC PN: C599613